# Altium schematic sheet QRNG.SchDoc
size A4; DocumentNumber: 14; SheetNumber: 16; SheetTotal: 19
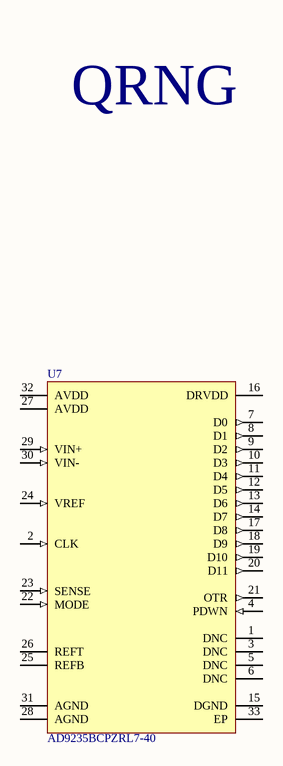
[diagram p0: QRNG.SchDoc]

## Parts
U7  AD9235BCPZRL7-40  [AD9235BCPZRL7-40]

## Nets

Not connected (* = marked no-connect by the designer): U7 1(DNC) 2(CLK) 3(DNC) 4(PDWN) 5(DNC) 6(DNC) 7(D0) 8(D1) 9(D2) 10(D3) 11(D4) 12(D5) 13(D6) 14(D7) 15(DGND) 16(DRVDD) 17(D8) 18(D9) 19(D10) 20(D11) 21(OTR) 22(MODE) 23(SENSE) 24(VREF) 25(REFB) 26(REFT) 27(AVDD) 28(AGND) 29(VIN+) 30(VIN-) 31(AGND) 32(AVDD) 33(EP)

## Notes on the sheet
- QRNG

## Library data of the parts
U7 = IC_AD9235BCPZRL7-40: Parallel 12 Bit ADC 40MSPS 1 Input Diff; Mfr: Analog Devices; Number of Bits: 12; Input Type: Differential / Single-Ended; Internal Reference: 500mV to 1V adj; Supply (Analog): 2.7V to 3.6V; Supply (Digital): 2.25V to 3.6V; Sample Rate: 40MSPS; Data Interface: Parallel; Operating Temperature: -40C to 85C; Created By: Pascal-Emmanuel Lachance; Supplier 1: Digi-Key; Supplier Part Number 1: 505-AD9235BCPZRL7-40CT-ND; ComponentLink1Description: Datasheet; ComponentLink1URL: https://www.analog.com/media/en/technical-documentation/data-sheets/AD9235.pdf; ComponentLink2Description: Digikey; ComponentLink2URL: https://www.digikey.ca/en/products/detail/analog-devices-inc/AD9235BCPZRL7-40/996171; ComponentLink3Description: Mouser; ComponentLink3URL: https://www.mouser.com/ProductDetail/Analog-Devices/AD9235BCPZRL7-40; ComponentLink4Description: Arrow; ComponentLink4URL: https://www.arrow.com/en/products/ad9235bcpzrl7-40/analog-devices; ComponentLink5Description: Octoparts; ComponentLink5URL: https://octopart.com/ad9235bcpzrl7-40-analog+devices-404113; ComponentLink6Description: Mfr Page; ComponentLink6URL: https://www.analog.com/en/products/ad9235.html